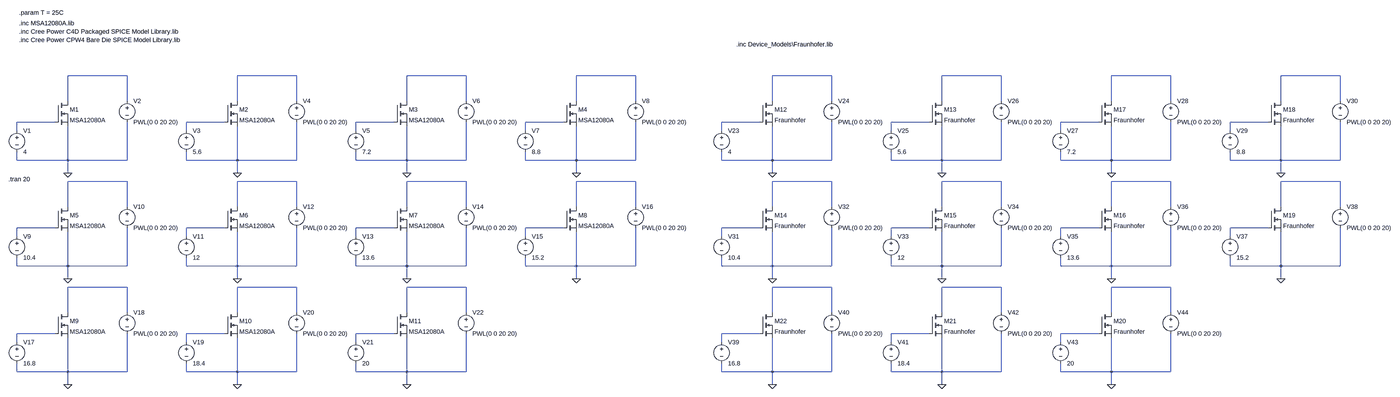
[diagram p0: schematic fwd_curves_2.asc, whole sheet]
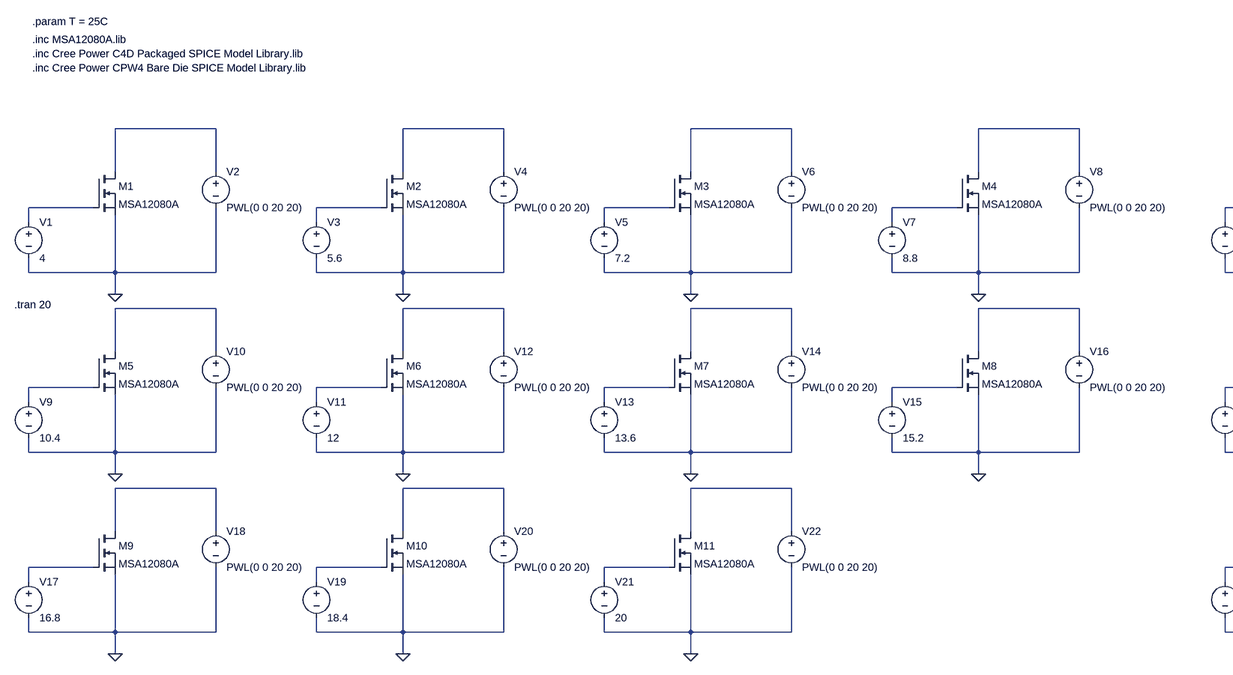
[diagram p1: schematic fwd_curves_2.asc, part, row 1 of 1, column 1 of 2]
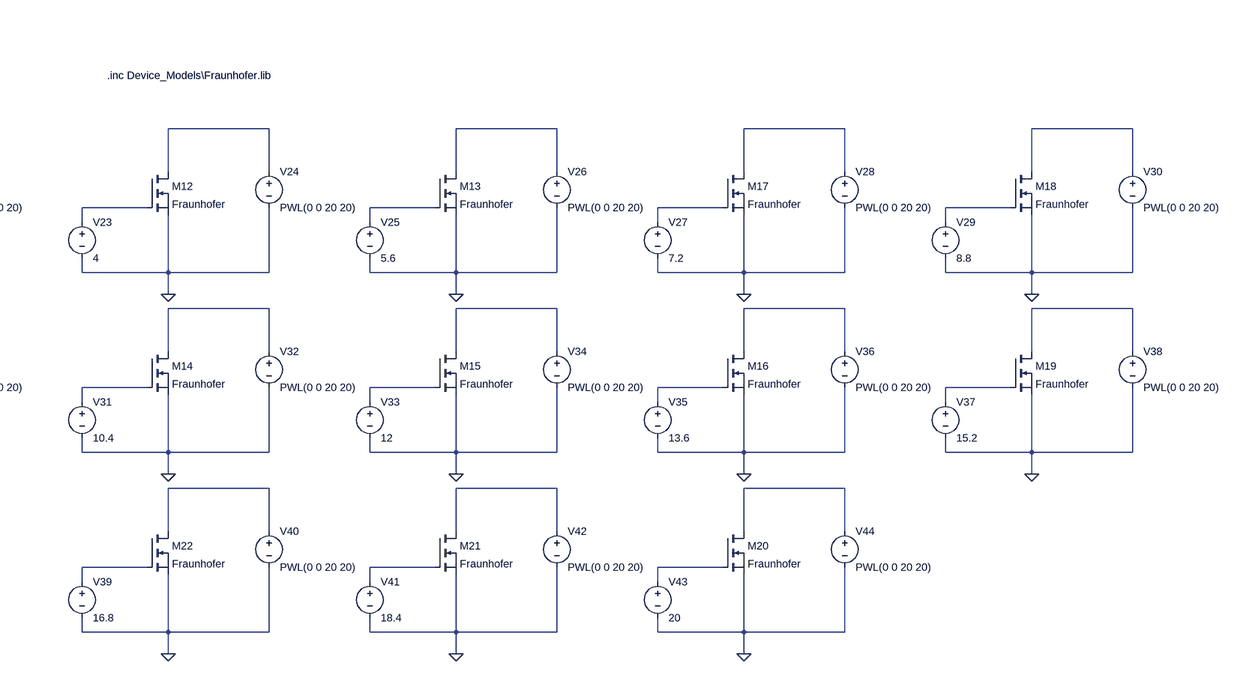
[diagram p2: schematic fwd_curves_2.asc, part, row 1 of 1, column 2 of 2]
fwd_curves_2.asc, the LTspice schematic file:
Version 4
SHEET 1 4496 1000
WIRE -304 -240 -528 -240
WIRE 336 -240 112 -240
WIRE 976 -240 752 -240
WIRE 1616 -240 1392 -240
WIRE 2368 -240 2144 -240
WIRE 3008 -240 2784 -240
WIRE 3648 -240 3424 -240
WIRE 4288 -240 4064 -240
WIRE -528 -144 -528 -240
WIRE -304 -144 -304 -240
WIRE 112 -144 112 -240
WIRE 336 -144 336 -240
WIRE 752 -144 752 -240
WIRE 976 -144 976 -240
WIRE 1392 -144 1392 -240
WIRE 1616 -144 1616 -240
WIRE 2144 -144 2144 -240
WIRE 2368 -144 2368 -240
WIRE 2784 -144 2784 -240
WIRE 3008 -144 3008 -240
WIRE 3424 -144 3424 -240
WIRE 3648 -144 3648 -240
WIRE 4064 -144 4064 -240
WIRE 4288 -144 4288 -240
WIRE -576 -64 -720 -64
WIRE 64 -64 -80 -64
WIRE 704 -64 560 -64
WIRE 1344 -64 1200 -64
WIRE 2096 -64 1952 -64
WIRE 2736 -64 2592 -64
WIRE 3376 -64 3232 -64
WIRE 4016 -64 3872 -64
WIRE -720 -32 -720 -64
WIRE -80 -32 -80 -64
WIRE 560 -32 560 -64
WIRE 1200 -32 1200 -64
WIRE 1952 -32 1952 -64
WIRE 2592 -32 2592 -64
WIRE 3232 -32 3232 -64
WIRE 3872 -32 3872 -64
WIRE -720 80 -720 48
WIRE -528 80 -528 -48
WIRE -528 80 -720 80
WIRE -304 80 -304 -64
WIRE -304 80 -528 80
WIRE -80 80 -80 48
WIRE 112 80 112 -48
WIRE 112 80 -80 80
WIRE 336 80 336 -64
WIRE 336 80 112 80
WIRE 560 80 560 48
WIRE 752 80 752 -48
WIRE 752 80 560 80
WIRE 976 80 976 -64
WIRE 976 80 752 80
WIRE 1200 80 1200 48
WIRE 1392 80 1392 -48
WIRE 1392 80 1200 80
WIRE 1616 80 1616 -64
WIRE 1616 80 1392 80
WIRE 1952 80 1952 48
WIRE 2144 80 2144 -48
WIRE 2144 80 1952 80
WIRE 2368 80 2368 -64
WIRE 2368 80 2144 80
WIRE 2592 80 2592 48
WIRE 2784 80 2784 -48
WIRE 2784 80 2592 80
WIRE 3008 80 3008 -64
WIRE 3008 80 2784 80
WIRE 3232 80 3232 48
WIRE 3424 80 3424 -48
WIRE 3424 80 3232 80
WIRE 3648 80 3648 -64
WIRE 3648 80 3424 80
WIRE 3872 80 3872 48
WIRE 4064 80 4064 -48
WIRE 4064 80 3872 80
WIRE 4288 80 4288 -64
WIRE 4288 80 4064 80
WIRE -528 128 -528 80
WIRE 112 128 112 80
WIRE 752 128 752 80
WIRE 1392 128 1392 80
WIRE 2144 128 2144 80
WIRE 2784 128 2784 80
WIRE 3424 128 3424 80
WIRE 4064 128 4064 80
WIRE -304 160 -528 160
WIRE 336 160 112 160
WIRE 976 160 752 160
WIRE 1616 160 1392 160
WIRE 2368 160 2144 160
WIRE 3008 160 2784 160
WIRE 3648 160 3424 160
WIRE 4288 160 4064 160
WIRE -528 256 -528 160
WIRE -304 256 -304 160
WIRE 112 256 112 160
WIRE 336 256 336 160
WIRE 752 256 752 160
WIRE 976 256 976 160
WIRE 1392 256 1392 160
WIRE 1616 256 1616 160
WIRE 2144 256 2144 160
WIRE 2368 256 2368 160
WIRE 2784 256 2784 160
WIRE 3008 256 3008 160
WIRE 3424 256 3424 160
WIRE 3648 256 3648 160
WIRE 4064 256 4064 160
WIRE 4288 256 4288 160
WIRE -576 336 -720 336
WIRE 64 336 -80 336
WIRE 704 336 560 336
WIRE 1344 336 1200 336
WIRE 2096 336 1952 336
WIRE 2736 336 2592 336
WIRE 3376 336 3232 336
WIRE 4016 336 3872 336
WIRE -720 368 -720 336
WIRE -80 368 -80 336
WIRE 560 368 560 336
WIRE 1200 368 1200 336
WIRE 1952 368 1952 336
WIRE 2592 368 2592 336
WIRE 3232 368 3232 336
WIRE 3872 368 3872 336
WIRE -720 480 -720 448
WIRE -528 480 -528 352
WIRE -528 480 -720 480
WIRE -304 480 -304 336
WIRE -304 480 -528 480
WIRE -80 480 -80 448
WIRE 112 480 112 352
WIRE 112 480 -80 480
WIRE 336 480 336 336
WIRE 336 480 112 480
WIRE 560 480 560 448
WIRE 752 480 752 352
WIRE 752 480 560 480
WIRE 976 480 976 336
WIRE 976 480 752 480
WIRE 1200 480 1200 448
WIRE 1392 480 1392 352
WIRE 1392 480 1200 480
WIRE 1616 480 1616 336
WIRE 1616 480 1392 480
WIRE 1952 480 1952 448
WIRE 2144 480 2144 352
WIRE 2144 480 1952 480
WIRE 2368 480 2368 336
WIRE 2368 480 2144 480
WIRE 2592 480 2592 448
WIRE 2784 480 2784 352
WIRE 2784 480 2592 480
WIRE 3008 480 3008 336
WIRE 3008 480 2784 480
WIRE 3232 480 3232 448
WIRE 3424 480 3424 352
WIRE 3424 480 3232 480
WIRE 3648 480 3648 336
WIRE 3648 480 3424 480
WIRE 3872 480 3872 448
WIRE 4064 480 4064 352
WIRE 4064 480 3872 480
WIRE 4288 480 4288 336
WIRE 4288 480 4064 480
WIRE -528 528 -528 480
WIRE 112 528 112 480
WIRE 752 528 752 480
WIRE 1392 528 1392 480
WIRE 2144 528 2144 480
WIRE 2784 528 2784 480
WIRE 3424 528 3424 480
WIRE 4064 528 4064 480
WIRE -304 560 -528 560
WIRE 336 560 112 560
WIRE 976 560 752 560
WIRE 2368 560 2144 560
WIRE 3008 560 2784 560
WIRE 3648 560 3424 560
WIRE -528 656 -528 560
WIRE -304 656 -304 560
WIRE 112 656 112 560
WIRE 336 656 336 560
WIRE 752 656 752 560
WIRE 976 656 976 560
WIRE 2144 656 2144 560
WIRE 2368 656 2368 560
WIRE 2784 656 2784 560
WIRE 3008 656 3008 560
WIRE 3424 656 3424 560
WIRE 3648 656 3648 560
WIRE -576 736 -720 736
WIRE 64 736 -80 736
WIRE 704 736 560 736
WIRE 2096 736 1952 736
WIRE 2736 736 2592 736
WIRE 3376 736 3232 736
WIRE -720 768 -720 736
WIRE -80 768 -80 736
WIRE 560 768 560 736
WIRE 1952 768 1952 736
WIRE 2592 768 2592 736
WIRE 3232 768 3232 736
WIRE -720 880 -720 848
WIRE -528 880 -528 752
WIRE -528 880 -720 880
WIRE -304 880 -304 736
WIRE -304 880 -528 880
WIRE -80 880 -80 848
WIRE 112 880 112 752
WIRE 112 880 -80 880
WIRE 336 880 336 736
WIRE 336 880 112 880
WIRE 560 880 560 848
WIRE 752 880 752 752
WIRE 752 880 560 880
WIRE 976 880 976 736
WIRE 976 880 752 880
WIRE 1952 880 1952 848
WIRE 2144 880 2144 752
WIRE 2144 880 1952 880
WIRE 2368 880 2368 736
WIRE 2368 880 2144 880
WIRE 2592 880 2592 848
WIRE 2784 880 2784 752
WIRE 2784 880 2592 880
WIRE 3008 880 3008 736
WIRE 3008 880 2784 880
WIRE 3232 880 3232 848
WIRE 3424 880 3424 752
WIRE 3424 880 3232 880
WIRE 3648 880 3648 736
WIRE 3648 880 3424 880
WIRE -528 928 -528 880
WIRE 112 928 112 880
WIRE 752 928 752 880
WIRE 2144 928 2144 880
WIRE 2784 928 2784 880
WIRE 3424 928 3424 880
FLAG -528 128 0
FLAG 112 128 0
FLAG 752 128 0
FLAG 1392 128 0
FLAG -528 528 0
FLAG 112 528 0
FLAG 752 528 0
FLAG 1392 528 0
FLAG -528 928 0
FLAG 112 928 0
FLAG 752 928 0
FLAG 2144 128 0
FLAG 2784 128 0
FLAG 3424 128 0
FLAG 4064 128 0
FLAG 2144 528 0
FLAG 2784 528 0
FLAG 3424 528 0
FLAG 4064 528 0
FLAG 2144 928 0
FLAG 2784 928 0
FLAG 3424 928 0
SYMBOL nmos -576 -144 R0
SYMATTR InstName M1
SYMATTR Value MSA12080A
SYMATTR Prefix X
SYMBOL voltage -720 -48 R0
WINDOW 123 0 0 Left 0
WINDOW 39 0 0 Left 0
SYMATTR InstName V1
SYMATTR Value 4
SYMBOL voltage -304 -160 R0
WINDOW 123 0 0 Left 0
WINDOW 39 0 0 Left 0
SYMATTR InstName V2
SYMATTR Value PWL(0 0 20 20)
SYMBOL nmos 64 -144 R0
SYMATTR InstName M2
SYMATTR Value MSA12080A
SYMATTR Prefix X
SYMBOL voltage -80 -48 R0
WINDOW 123 0 0 Left 0
WINDOW 39 0 0 Left 0
SYMATTR InstName V3
SYMATTR Value 5.6
SYMBOL voltage 336 -160 R0
WINDOW 123 0 0 Left 0
WINDOW 39 0 0 Left 0
SYMATTR InstName V4
SYMATTR Value PWL(0 0 20 20)
SYMBOL nmos 704 -144 R0
SYMATTR InstName M3
SYMATTR Value MSA12080A
SYMATTR Prefix X
SYMBOL voltage 560 -48 R0
WINDOW 123 0 0 Left 0
WINDOW 39 0 0 Left 0
SYMATTR InstName V5
SYMATTR Value 7.2
SYMBOL voltage 976 -160 R0
WINDOW 123 0 0 Left 0
WINDOW 39 0 0 Left 0
SYMATTR InstName V6
SYMATTR Value PWL(0 0 20 20)
SYMBOL nmos 1344 -144 R0
SYMATTR InstName M4
SYMATTR Value MSA12080A
SYMATTR Prefix X
SYMBOL voltage 1200 -48 R0
WINDOW 123 0 0 Left 0
WINDOW 39 0 0 Left 0
SYMATTR InstName V7
SYMATTR Value 8.8
SYMBOL voltage 1616 -160 R0
WINDOW 123 0 0 Left 0
WINDOW 39 0 0 Left 0
SYMATTR InstName V8
SYMATTR Value PWL(0 0 20 20)
SYMBOL nmos -576 256 R0
SYMATTR InstName M5
SYMATTR Value MSA12080A
SYMATTR Prefix X
SYMBOL voltage -720 352 R0
WINDOW 123 0 0 Left 0
WINDOW 39 0 0 Left 0
SYMATTR InstName V9
SYMATTR Value 10.4
SYMBOL voltage -304 240 R0
WINDOW 123 0 0 Left 0
WINDOW 39 0 0 Left 0
SYMATTR InstName V10
SYMATTR Value PWL(0 0 20 20)
SYMBOL nmos 64 256 R0
SYMATTR InstName M6
SYMATTR Value MSA12080A
SYMATTR Prefix X
SYMBOL voltage -80 352 R0
WINDOW 123 0 0 Left 0
WINDOW 39 0 0 Left 0
SYMATTR InstName V11
SYMATTR Value 12
SYMBOL voltage 336 240 R0
WINDOW 123 0 0 Left 0
WINDOW 39 0 0 Left 0
SYMATTR InstName V12
SYMATTR Value PWL(0 0 20 20)
SYMBOL nmos 704 256 R0
SYMATTR InstName M7
SYMATTR Value MSA12080A
SYMATTR Prefix X
SYMBOL voltage 560 352 R0
WINDOW 123 0 0 Left 0
WINDOW 39 0 0 Left 0
SYMATTR InstName V13
SYMATTR Value 13.6
SYMBOL voltage 976 240 R0
WINDOW 123 0 0 Left 0
WINDOW 39 0 0 Left 0
SYMATTR InstName V14
SYMATTR Value PWL(0 0 20 20)
SYMBOL nmos 1344 256 R0
SYMATTR InstName M8
SYMATTR Value MSA12080A
SYMATTR Prefix X
SYMBOL voltage 1200 352 R0
WINDOW 123 0 0 Left 0
WINDOW 39 0 0 Left 0
SYMATTR InstName V15
SYMATTR Value 15.2
SYMBOL voltage 1616 240 R0
WINDOW 123 0 0 Left 0
WINDOW 39 0 0 Left 0
SYMATTR InstName V16
SYMATTR Value PWL(0 0 20 20)
SYMBOL nmos -576 656 R0
SYMATTR InstName M9
SYMATTR Value MSA12080A
SYMATTR Prefix X
SYMBOL voltage -720 752 R0
WINDOW 123 0 0 Left 0
WINDOW 39 0 0 Left 0
SYMATTR InstName V17
SYMATTR Value 16.8
SYMBOL voltage -304 640 R0
WINDOW 123 0 0 Left 0
WINDOW 39 0 0 Left 0
SYMATTR InstName V18
SYMATTR Value PWL(0 0 20 20)
SYMBOL nmos 64 656 R0
SYMATTR InstName M10
SYMATTR Value MSA12080A
SYMATTR Prefix X
SYMBOL voltage -80 752 R0
WINDOW 123 0 0 Left 0
WINDOW 39 0 0 Left 0
SYMATTR InstName V19
SYMATTR Value 18.4
SYMBOL voltage 336 640 R0
WINDOW 123 0 0 Left 0
WINDOW 39 0 0 Left 0
SYMATTR InstName V20
SYMATTR Value PWL(0 0 20 20)
SYMBOL nmos 704 656 R0
SYMATTR InstName M11
SYMATTR Value MSA12080A
SYMATTR Prefix X
SYMBOL voltage 560 752 R0
WINDOW 123 0 0 Left 0
WINDOW 39 0 0 Left 0
SYMATTR InstName V21
SYMATTR Value 20
SYMBOL voltage 976 640 R0
WINDOW 123 0 0 Left 0
WINDOW 39 0 0 Left 0
SYMATTR InstName V22
SYMATTR Value PWL(0 0 20 20)
SYMBOL nmos 2096 -144 R0
SYMATTR InstName M12
SYMATTR Value Fraunhofer
SYMATTR Prefix X
SYMBOL voltage 1952 -48 R0
WINDOW 123 0 0 Left 0
WINDOW 39 0 0 Left 0
SYMATTR InstName V23
SYMATTR Value 4
SYMBOL voltage 2368 -160 R0
WINDOW 123 0 0 Left 0
WINDOW 39 0 0 Left 0
SYMATTR InstName V24
SYMATTR Value PWL(0 0 20 20)
SYMBOL voltage 2592 -48 R0
WINDOW 123 0 0 Left 0
WINDOW 39 0 0 Left 0
SYMATTR InstName V25
SYMATTR Value 5.6
SYMBOL voltage 3008 -160 R0
WINDOW 123 0 0 Left 0
WINDOW 39 0 0 Left 0
SYMATTR InstName V26
SYMATTR Value PWL(0 0 20 20)
SYMBOL voltage 3232 -48 R0
WINDOW 123 0 0 Left 0
WINDOW 39 0 0 Left 0
SYMATTR InstName V27
SYMATTR Value 7.2
SYMBOL voltage 3648 -160 R0
WINDOW 123 0 0 Left 0
WINDOW 39 0 0 Left 0
SYMATTR InstName V28
SYMATTR Value PWL(0 0 20 20)
SYMBOL voltage 3872 -48 R0
WINDOW 123 0 0 Left 0
WINDOW 39 0 0 Left 0
SYMATTR InstName V29
SYMATTR Value 8.8
SYMBOL voltage 4288 -160 R0
WINDOW 123 0 0 Left 0
WINDOW 39 0 0 Left 0
SYMATTR InstName V30
SYMATTR Value PWL(0 0 20 20)
SYMBOL voltage 1952 352 R0
WINDOW 123 0 0 Left 0
WINDOW 39 0 0 Left 0
SYMATTR InstName V31
SYMATTR Value 10.4
SYMBOL voltage 2368 240 R0
WINDOW 123 0 0 Left 0
WINDOW 39 0 0 Left 0
SYMATTR InstName V32
SYMATTR Value PWL(0 0 20 20)
SYMBOL voltage 2592 352 R0
WINDOW 123 0 0 Left 0
WINDOW 39 0 0 Left 0
SYMATTR InstName V33
SYMATTR Value 12
SYMBOL voltage 3008 240 R0
WINDOW 123 0 0 Left 0
WINDOW 39 0 0 Left 0
SYMATTR InstName V34
SYMATTR Value PWL(0 0 20 20)
SYMBOL voltage 3232 352 R0
WINDOW 123 0 0 Left 0
WINDOW 39 0 0 Left 0
SYMATTR InstName V35
SYMATTR Value 13.6
SYMBOL voltage 3648 240 R0
WINDOW 123 0 0 Left 0
WINDOW 39 0 0 Left 0
SYMATTR InstName V36
SYMATTR Value PWL(0 0 20 20)
SYMBOL voltage 3872 352 R0
WINDOW 123 0 0 Left 0
WINDOW 39 0 0 Left 0
SYMATTR InstName V37
SYMATTR Value 15.2
SYMBOL voltage 4288 240 R0
WINDOW 123 0 0 Left 0
WINDOW 39 0 0 Left 0
SYMATTR InstName V38
SYMATTR Value PWL(0 0 20 20)
SYMBOL voltage 1952 752 R0
WINDOW 123 0 0 Left 0
WINDOW 39 0 0 Left 0
SYMATTR InstName V39
SYMATTR Value 16.8
SYMBOL voltage 2368 640 R0
WINDOW 123 0 0 Left 0
WINDOW 39 0 0 Left 0
SYMATTR InstName V40
SYMATTR Value PWL(0 0 20 20)
SYMBOL voltage 2592 752 R0
WINDOW 123 0 0 Left 0
WINDOW 39 0 0 Left 0
SYMATTR InstName V41
SYMATTR Value 18.4
SYMBOL voltage 3008 640 R0
WINDOW 123 0 0 Left 0
WINDOW 39 0 0 Left 0
SYMATTR InstName V42
SYMATTR Value PWL(0 0 20 20)
SYMBOL voltage 3232 752 R0
WINDOW 123 0 0 Left 0
WINDOW 39 0 0 Left 0
SYMATTR InstName V43
SYMATTR Value 20
SYMBOL voltage 3648 640 R0
WINDOW 123 0 0 Left 0
WINDOW 39 0 0 Left 0
SYMATTR InstName V44
SYMATTR Value PWL(0 0 20 20)
SYMBOL nmos 2736 -144 R0
SYMATTR InstName M13
SYMATTR Value Fraunhofer
SYMATTR Prefix X
SYMBOL nmos 2096 256 R0
SYMATTR InstName M14
SYMATTR Value Fraunhofer
SYMATTR Prefix X
SYMBOL nmos 2736 256 R0
SYMATTR InstName M15
SYMATTR Value Fraunhofer
SYMATTR Prefix X
SYMBOL nmos 3376 256 R0
SYMATTR InstName M16
SYMATTR Value Fraunhofer
SYMATTR Prefix X
SYMBOL nmos 3376 -144 R0
SYMATTR InstName M17
SYMATTR Value Fraunhofer
SYMATTR Prefix X
SYMBOL nmos 4016 -144 R0
SYMATTR InstName M18
SYMATTR Value Fraunhofer
SYMATTR Prefix X
SYMBOL nmos 4016 256 R0
SYMATTR InstName M19
SYMATTR Value Fraunhofer
SYMATTR Prefix X
SYMBOL nmos 3376 656 R0
SYMATTR InstName M20
SYMATTR Value Fraunhofer
SYMATTR Prefix X
SYMBOL nmos 2736 656 R0
SYMATTR InstName M21
SYMATTR Value Fraunhofer
SYMATTR Prefix X
SYMBOL nmos 2096 656 R0
SYMATTR InstName M22
SYMATTR Value Fraunhofer
SYMATTR Prefix X
TEXT -752 152 Left 2 !.tran 20
TEXT -712 -472 Left 2 !.inc MSA12080A.lib
TEXT -712 -512 Left 2 !.param T = 25C
TEXT -712 -440 Left 2 !.inc Cree Power C4D Packaged SPICE Model Library.lib
TEXT -712 -408 Left 2 !.inc Cree Power CPW4 Bare Die SPICE Model Library.lib
TEXT 2008 -392 Left 2 !.inc Device_Models\\Fraunhofer.lib

The netlist it stands for:
* fwd_curves_2.asc
XM1 N001 N009 0 MSA12080A  ; pins D G S
V1 N009 0 4
V2 N001 0 PWL(0 0 20 20)
XM2 N002 N010 0 MSA12080A  ; pins D G S
V3 N010 0 5.6
V4 N002 0 PWL(0 0 20 20)
XM3 N003 N011 0 MSA12080A  ; pins D G S
V5 N011 0 7.2
V6 N003 0 PWL(0 0 20 20)
XM4 N004 N012 0 MSA12080A  ; pins D G S
V7 N012 0 8.8
V8 N004 0 PWL(0 0 20 20)
XM5 N017 N025 0 MSA12080A  ; pins D G S
V9 N025 0 10.4
V10 N017 0 PWL(0 0 20 20)
XM6 N018 N026 0 MSA12080A  ; pins D G S
V11 N026 0 12
V12 N018 0 PWL(0 0 20 20)
XM7 N019 N027 0 MSA12080A  ; pins D G S
V13 N027 0 13.6
V14 N019 0 PWL(0 0 20 20)
XM8 N020 N028 0 MSA12080A  ; pins D G S
V15 N028 0 15.2
V16 N020 0 PWL(0 0 20 20)
XM9 N033 N039 0 MSA12080A  ; pins D G S
V17 N039 0 16.8
V18 N033 0 PWL(0 0 20 20)
XM10 N034 N040 0 MSA12080A  ; pins D G S
V19 N040 0 18.4
V20 N034 0 PWL(0 0 20 20)
XM11 N035 N041 0 MSA12080A  ; pins D G S
V21 N041 0 20
V22 N035 0 PWL(0 0 20 20)
XM12 N005 N013 0 Fraunhofer  ; pins D G S
V23 N013 0 4
V24 N005 0 PWL(0 0 20 20)
V25 N014 0 5.6
V26 N006 0 PWL(0 0 20 20)
V27 N015 0 7.2
V28 N007 0 PWL(0 0 20 20)
V29 N016 0 8.8
V30 N008 0 PWL(0 0 20 20)
V31 N029 0 10.4
V32 N021 0 PWL(0 0 20 20)
V33 N030 0 12
V34 N022 0 PWL(0 0 20 20)
V35 N031 0 13.6
V36 N023 0 PWL(0 0 20 20)
V37 N032 0 15.2
V38 N024 0 PWL(0 0 20 20)
V39 N042 0 16.8
V40 N036 0 PWL(0 0 20 20)
V41 N043 0 18.4
V42 N037 0 PWL(0 0 20 20)
V43 N044 0 20
V44 N038 0 PWL(0 0 20 20)
XM13 N006 N014 0 Fraunhofer  ; pins D G S
XM14 N021 N029 0 Fraunhofer  ; pins D G S
XM15 N022 N030 0 Fraunhofer  ; pins D G S
XM16 N023 N031 0 Fraunhofer  ; pins D G S
XM17 N007 N015 0 Fraunhofer  ; pins D G S
XM18 N008 N016 0 Fraunhofer  ; pins D G S
XM19 N024 N032 0 Fraunhofer  ; pins D G S
XM20 N038 N044 0 Fraunhofer  ; pins D G S
XM21 N037 N043 0 Fraunhofer  ; pins D G S
XM22 N036 N042 0 Fraunhofer  ; pins D G S
.tran 20
.inc MSA12080A.lib
.param T = 25C
.inc Cree Power C4D Packaged SPICE Model Library.lib
.inc Cree Power CPW4 Bare Die SPICE Model Library.lib
.inc Device_Models\Fraunhofer.lib
.backanno
.end